# EasyEDA schematic easyeda-schematics.json

## Sheets
1 Digital Inputs: TITLE: Korg Volca Beats CV2MIDI / Analog inputs; REV: 1.0; Date: 2020-05-28; Sheet: 3/3; Drawn By: Arthur LAURENT; Company: N/A
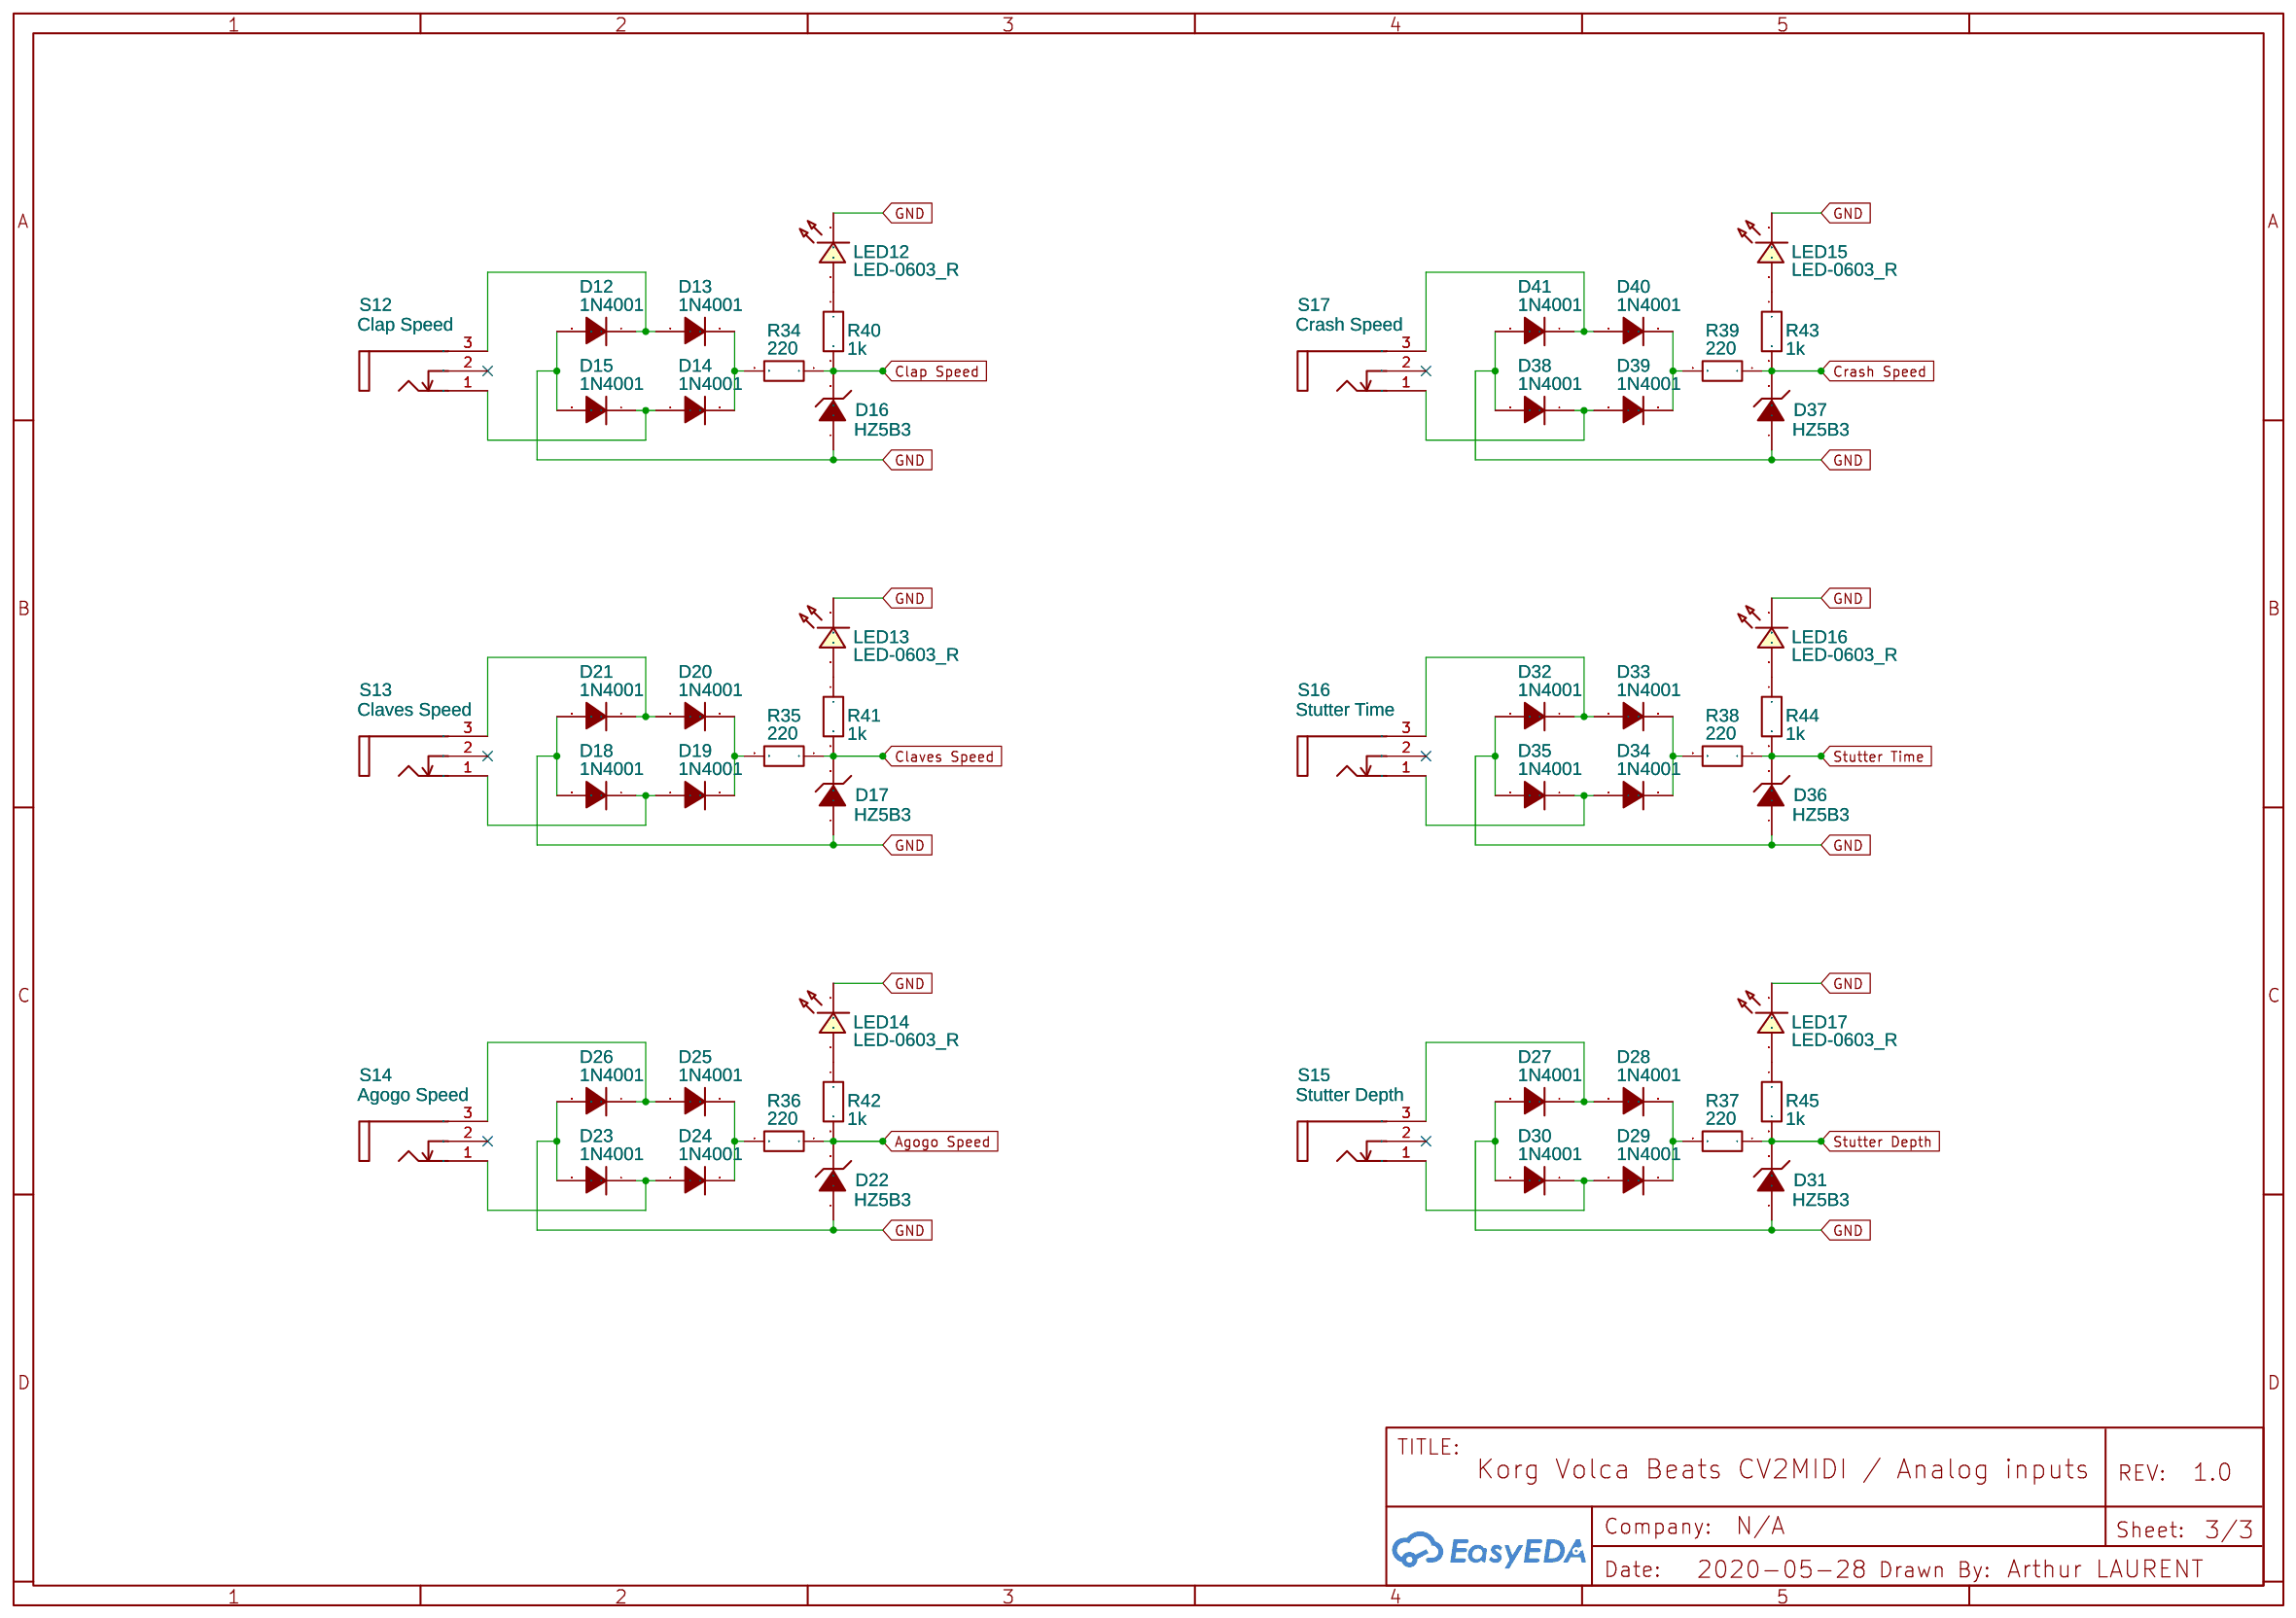
[diagram p0: Digital Inputs]
2 Arduino: TITLE: Korg Volca Beats CV2MIDI - Arduino; Sheet: 1/3
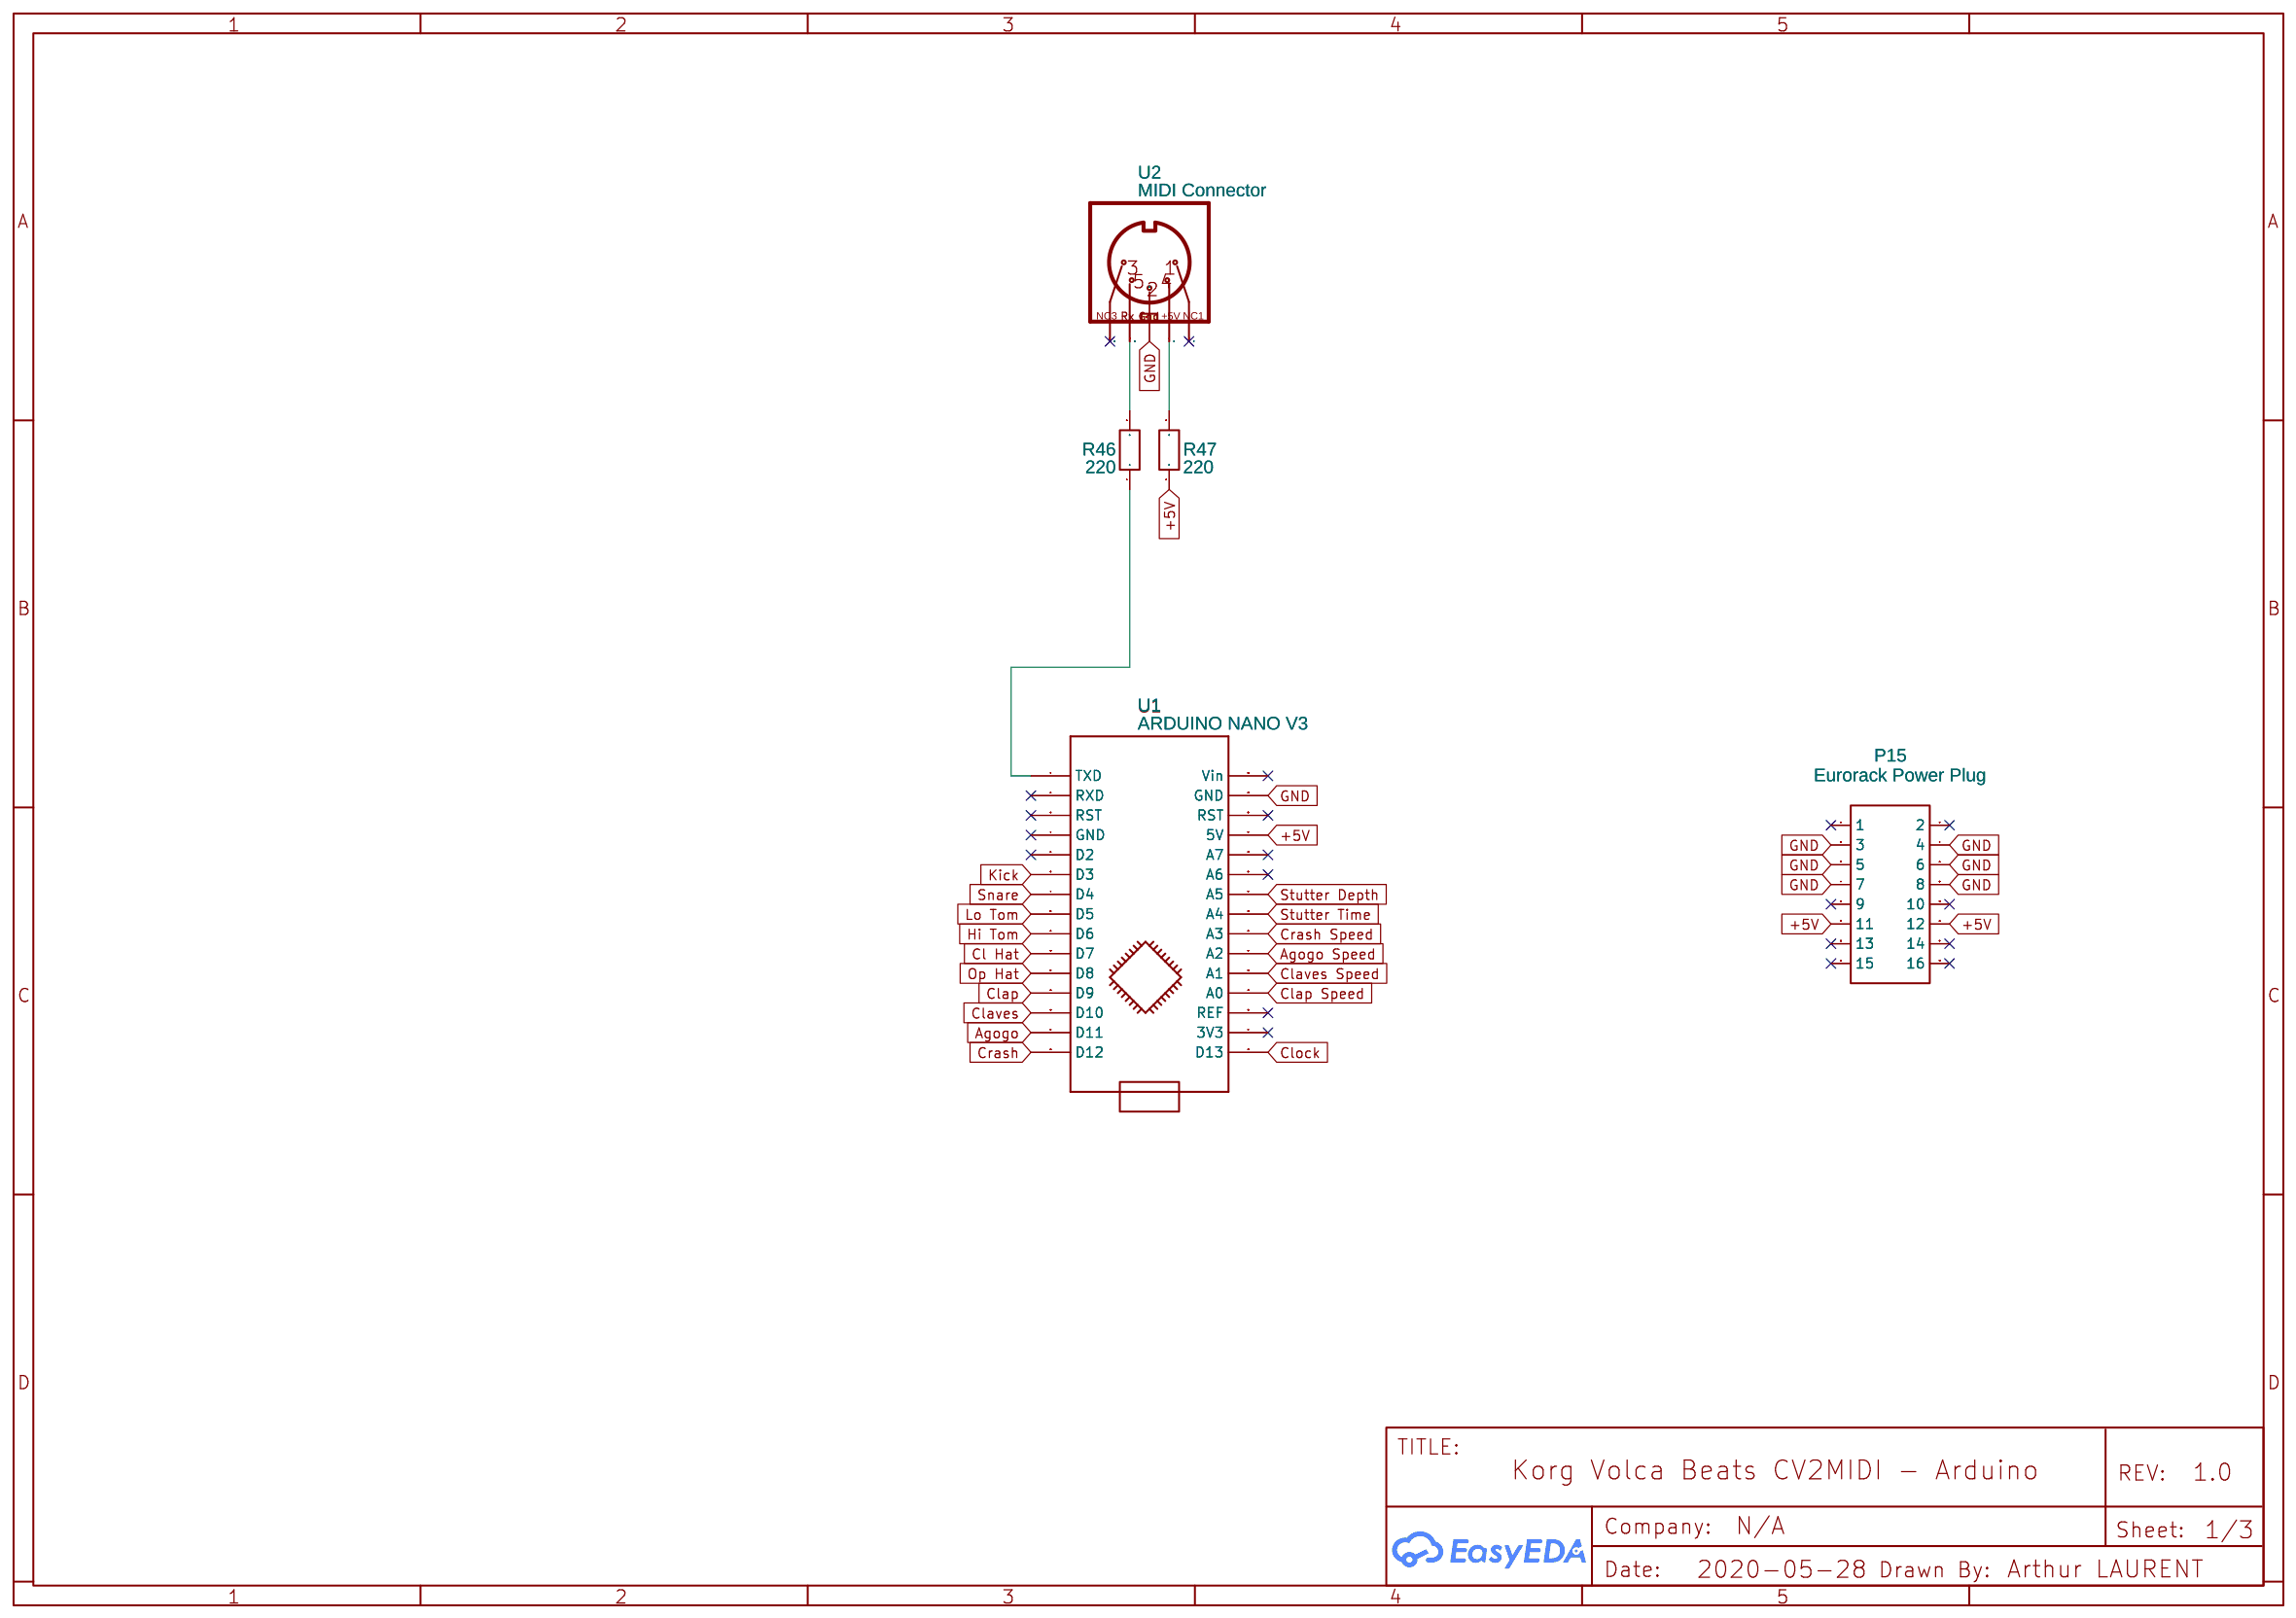
[diagram p1: Arduino]
3 Analog Inputs: TITLE: Korg Volca Beats CV2MIDI / Digital inputs; Sheet: 2/3
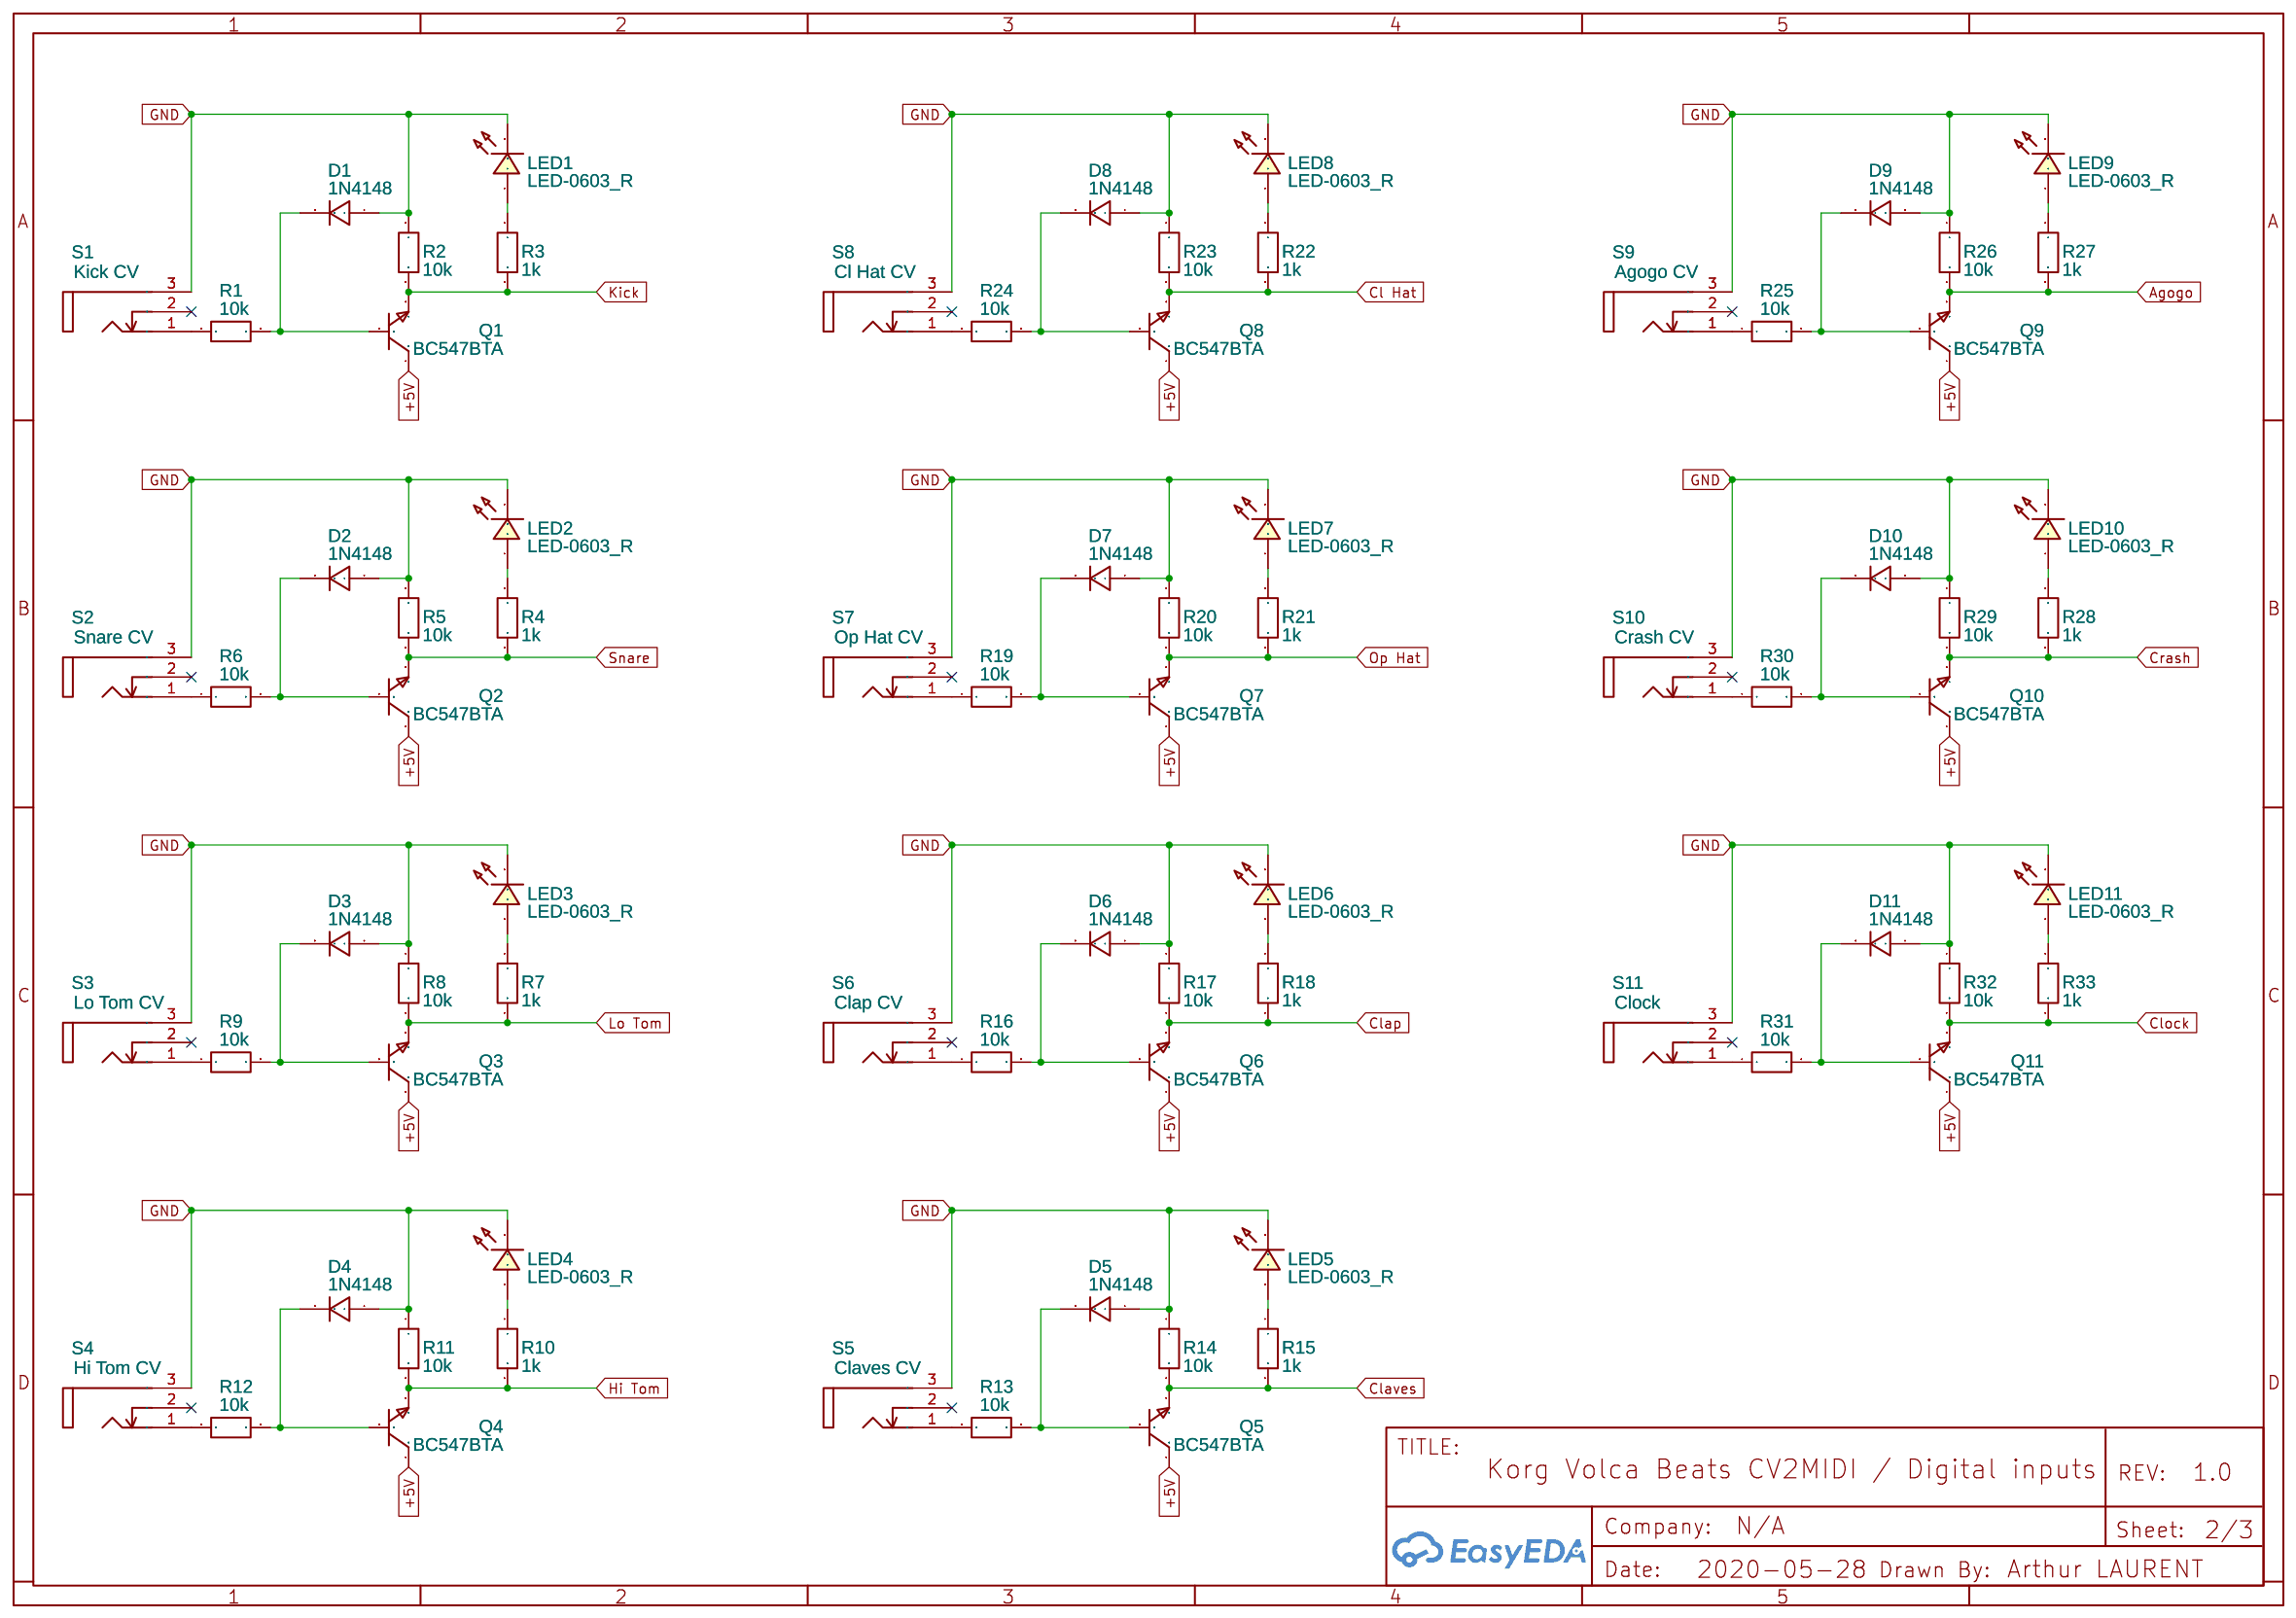
[diagram p2: Analog Inputs]

## Parts
sheet Analog Inputs
D1  1N4148  [DO-35]
D2  1N4148  [DO-35]
D3  1N4148  [DO-35]
D4  1N4148  [DO-35]
D5  1N4148  [DO-35]
D6  1N4148  [DO-35]
D7  1N4148  [DO-35]
D8  1N4148  [DO-35]
D9  1N4148  [DO-35]
D10  1N4148  [DO-35]
D11  1N4148  [DO-35]
LED1  LED-0603_R  [LED0603_RED]
LED2  LED-0603_R  [LED0603_RED]
LED3  LED-0603_R  [LED0603_RED]
LED4  LED-0603_R  [LED0603_RED]
LED5  LED-0603_R  [LED0603_RED]
LED6  LED-0603_R  [LED0603_RED]
LED7  LED-0603_R  [LED0603_RED]
LED8  LED-0603_R  [LED0603_RED]
LED9  LED-0603_R  [LED0603_RED]
LED10  LED-0603_R  [LED0603_RED]
LED11  LED-0603_R  [LED0603_RED]
Q1  BC547BTA  [TO-92-3_L4.8-W3.7-P2.54-L]
Q2  BC547BTA  [TO-92-3_L4.8-W3.7-P2.54-L]
Q3  BC547BTA  [TO-92-3_L4.8-W3.7-P2.54-L]
Q4  BC547BTA  [TO-92-3_L4.8-W3.7-P2.54-L]
Q5  BC547BTA  [TO-92-3_L4.8-W3.7-P2.54-L]
Q6  BC547BTA  [TO-92-3_L4.8-W3.7-P2.54-L]
Q7  BC547BTA  [TO-92-3_L4.8-W3.7-P2.54-L]
Q8  BC547BTA  [TO-92-3_L4.8-W3.7-P2.54-L]
Q9  BC547BTA  [TO-92-3_L4.8-W3.7-P2.54-L]
Q10  BC547BTA  [TO-92-3_L4.8-W3.7-P2.54-L]
Q11  BC547BTA  [TO-92-3_L4.8-W3.7-P2.54-L]
R1  10k  [R0201]
R2  10k  [R0201]
R3  1k  [R0201]
R4  1k  [R0201]
R5  10k  [R0201]
R6  10k  [R0201]
R7  1k  [R0201]
R8  10k  [R0201]
R9  10k  [R0201]
R10  1k  [R0201]
R11  10k  [R0201]
R12  10k  [R0201]
R13  10k  [R0201]
R14  10k  [R0201]
R15  1k  [R0201]
R16  10k  [R0201]
R17  10k  [R0201]
R18  1k  [R0201]
R19  10k  [R0201]
R20  10k  [R0201]
R21  1k  [R0201]
R22  1k  [R0201]
R23  10k  [R0201]
R24  10k  [R0201]
R25  10k  [R0201]
R26  10k  [R0201]
R27  1k  [R0201]
R28  1k  [R0201]
R29  10k  [R0201]
R30  10k  [R0201]
R31  10k  [R0201]
R32  10k  [R0201]
R33  1k  [R0201]
S1  Kick CV  [JACK-3PIN]
S2  Snare CV  [JACK-3PIN]
S3  Lo Tom CV  [JACK-3PIN]
S4  Hi Tom CV  [JACK-3PIN]
S5  Claves CV  [JACK-3PIN]
S6  Clap CV  [JACK-3PIN]
S7  Op Hat CV  [JACK-3PIN]
S8  Cl Hat CV  [JACK-3PIN]
S9  Agogo CV  [JACK-3PIN]
S10  Crash CV  [JACK-3PIN]
S11  Clock  [JACK-3PIN]
sheet Arduino
P15  Eurorack Power Plug  [IDC-TH_16P-P2.54_C3406]
R46  220  [R0201]
R47  220  [R0201]
U1  ARDUINO NANO V3  [ARDUINO NANO V3]
U2  MIDI Connector  [SDS-50J]
sheet Digital Inputs
D12  1N4001  [DO-41_BD2.4-L4.7-P8.70-D0.9-RD]
D13  1N4001  [DO-41_BD2.4-L4.7-P8.70-D0.9-RD]
D14  1N4001  [DO-41_BD2.4-L4.7-P8.70-D0.9-RD]
D15  1N4001  [DO-41_BD2.4-L4.7-P8.70-D0.9-RD]
D16  HZ5B3  [DO-35_BD2.0-L4.2-P8.20-D0.5-R-RD]
D17  HZ5B3  [DO-35_BD2.0-L4.2-P8.20-D0.5-R-RD]
D18  1N4001  [DO-41_BD2.4-L4.7-P8.70-D0.9-RD]
D19  1N4001  [DO-41_BD2.4-L4.7-P8.70-D0.9-RD]
D20  1N4001  [DO-41_BD2.4-L4.7-P8.70-D0.9-RD]
D21  1N4001  [DO-41_BD2.4-L4.7-P8.70-D0.9-RD]
D22  HZ5B3  [DO-35_BD2.0-L4.2-P8.20-D0.5-R-RD]
D23  1N4001  [DO-41_BD2.4-L4.7-P8.70-D0.9-RD]
D24  1N4001  [DO-41_BD2.4-L4.7-P8.70-D0.9-RD]
D25  1N4001  [DO-41_BD2.4-L4.7-P8.70-D0.9-RD]
D26  1N4001  [DO-41_BD2.4-L4.7-P8.70-D0.9-RD]
D27  1N4001  [DO-41_BD2.4-L4.7-P8.70-D0.9-RD]
D28  1N4001  [DO-41_BD2.4-L4.7-P8.70-D0.9-RD]
D29  1N4001  [DO-41_BD2.4-L4.7-P8.70-D0.9-RD]
D30  1N4001  [DO-41_BD2.4-L4.7-P8.70-D0.9-RD]
D31  HZ5B3  [DO-35_BD2.0-L4.2-P8.20-D0.5-R-RD]
D32  1N4001  [DO-41_BD2.4-L4.7-P8.70-D0.9-RD]
D33  1N4001  [DO-41_BD2.4-L4.7-P8.70-D0.9-RD]
D34  1N4001  [DO-41_BD2.4-L4.7-P8.70-D0.9-RD]
D35  1N4001  [DO-41_BD2.4-L4.7-P8.70-D0.9-RD]
D36  HZ5B3  [DO-35_BD2.0-L4.2-P8.20-D0.5-R-RD]
D37  HZ5B3  [DO-35_BD2.0-L4.2-P8.20-D0.5-R-RD]
D38  1N4001  [DO-41_BD2.4-L4.7-P8.70-D0.9-RD]
D39  1N4001  [DO-41_BD2.4-L4.7-P8.70-D0.9-RD]
D40  1N4001  [DO-41_BD2.4-L4.7-P8.70-D0.9-RD]
D41  1N4001  [DO-41_BD2.4-L4.7-P8.70-D0.9-RD]
LED12  LED-0603_R  [LED0603_RED]
LED13  LED-0603_R  [LED0603_RED]
LED14  LED-0603_R  [LED0603_RED]
LED15  LED-0603_R  [LED0603_RED]
LED16  LED-0603_R  [LED0603_RED]
LED17  LED-0603_R  [LED0603_RED]
R34  220  [R0201]
R35  220  [R0201]
R36  220  [R0201]
R37  220  [R0201]
R38  220  [R0201]
R39  220  [R0201]
R40  1k  [R0201]
R41  1k  [R0201]
R42  1k  [R0201]
R43  1k  [R0201]
R44  1k  [R0201]
R45  1k  [R0201]
S12  Clap Speed  [JACK-3PIN]
S13  Claves Speed  [JACK-3PIN]
S14  Agogo Speed  [JACK-3PIN]
S15  Stutter Depth  [JACK-3PIN]
S16  Stutter Time  [JACK-3PIN]
S17  Crash Speed  [JACK-3PIN]

## Library data of the parts
D1-D11 = 1N4148: Contributor: EasyEDA
LED1-LED17 = LED-0603_R: Manufacturer: EVERLIGHT(台湾亿光); Manufacturer Part: 19-217/R6C-AL1M2VY/3T; Supplier Part: C72044; Supplier: LCSC; Contributor: LCEDA_01
Q1-Q11 = BC547BTA: Supplier: LCSC; Supplier Part: C258144; Manufacturer: ON Semicon; Contributor: LCSC
R1-R47 = R_0201_EU: Contributor: LCEDA_Lib
S1-S17 = 3.5mm Jack Socket Mono: Contributor: daveh25
P15 = HDR-IDC-2.54-2X8P: Supplier: LCSC; Manufacturer: BOOMELE; Manufacturer Part: IDC Box 2.54mm 16P　Straight; image: //image.lceda.cn/szlcsc/C3406.jpg; Supplier Part: C3406
U1 = ARDUINO NANO V3: Manufacturer Part: arduino_nano1; Contributor: Labamich netvoll
U2 = MIDI Connector: Contributor: Janosch_89
D12-D15 D18-D21 D23-D30 D32-D35 D38-D41 = 1N4001: Supplier: LCSC; Manufacturer: LRC; Supplier Part: C82804
D16 D17 D22 D31 D36 D37 = HZ5B3: Supplier: LCSC; Manufacturer: SEMTECH; Supplier Part: C45643

## Nets
+5V: P15.11 P15.12 Q1.1(C) Q2.1(C) Q3.1(C) Q4.1(C) Q5.1(C) Q6.1(C) Q7.1(C) Q8.1(C) Q9.1(C) Q10.1(C) Q11.1(C) R47.1 U1.27(5V)
GND: D1.1(A) D2.1(A) D3.1(A) D4.1(A) D5.1(A) D6.1(A) D7.1(A) D8.1(A) D9.1(A) D10.1(A) D11.1(A) D12.2(A) D15.2(A) D16.1(A) D17.1(A) D18.2(A) D21.2(A) D22.1(A) D23.2(A) D26.2(A) D27.2(A) D30.2(A) D31.1(A) D32.2(A) D35.2(A) D36.1(A) D37.1(A) D38.2(A) D41.2(A) LED1.2 LED2.2 LED3.2 LED4.2 LED5.2 LED6.2 LED7.2 LED8.2 LED9.2 LED10.2 LED11.2 LED12.2 LED13.2 LED14.2 LED15.2 LED16.2 LED17.2 P15.3 P15.4 P15.5 P15.6 P15.7 P15.8 R2.1 R5.1 R8.1 R11.1 R14.1 R17.1 R20.1 R23.1 R26.1 R29.1 R32.1 S1.3(1) S2.3(1) S3.3(1) S4.3(1) S5.3(1) S6.3(1) S7.3(1) S8.3(1) S9.3(1) S10.3(1) S11.3(1) U1.29(GND) U2.2
Agogo: Q9.3(E) R26.2 R27.2 U1.14(D11)
Agogo Speed: D22.2(K) R36.1 R42.2 U1.21(A2)
Cl Hat: Q8.3(E) R22.2 R23.2 U1.10(D7)
Clap: Q6.3(E) R17.2 R18.2 U1.12(D9)
Clap Speed: D16.2(K) R34.1 R40.2 U1.19(A0)
Claves: Q5.3(E) R14.2 R15.2 U1.13(D10)
Claves Speed: D17.2(K) R35.1 R41.2 U1.20(A1)
Clock: Q11.3(E) R32.2 R33.2 U1.16(D13)
Crash: Q10.3(E) R28.2 R29.2 U1.15(D12)
Crash Speed: D37.2(K) R39.1 R43.2 U1.22(A3)
Hi Tom: Q4.3(E) R10.2 R11.2 U1.9(D6)
Kick: Q1.3(E) R2.2 R3.2 U1.6(D3)
Lo Tom: Q3.3(E) R7.2 R8.2 U1.8(D5)
Op Hat: Q7.3(E) R20.2 R21.2 U1.11(D8)
Snare: Q2.3(E) R4.2 R5.2 U1.7(D4)
Stutter Depth: D31.2(K) R37.1 R45.2 U1.24(A5)
Stutter Time: D36.2(K) R38.1 R44.2 U1.23(A4)
Net-(D1-2): D1.2(K) Q1.2(B) R1.2
Net-(D2-2): D2.2(K) Q2.2(B) R6.2
Net-(D3-2): D3.2(K) Q3.2(B) R9.2
Net-(D4-2): D4.2(K) Q4.2(B) R12.2
Net-(D5-2): D5.2(K) Q5.2(B) R13.2
Net-(D6-2): D6.2(K) Q6.2(B) R16.2
Net-(D7-2): D7.2(K) Q7.2(B) R19.2
Net-(D8-2): D8.2(K) Q8.2(B) R24.2
Net-(D9-2): D9.2(K) Q9.2(B) R25.2
Net-(D10-2): D10.2(K) Q10.2(B) R30.2
Net-(D11-2): D11.2(K) Q11.2(B) R31.2
Net-(D12-1): D12.1(K) D13.2(A) S12.3(1)
Net-(D13-1): D13.1(K) D14.1(K) R34.2
Net-(D14-2): D14.2(A) D15.1(K) S12.1(3)
Net-(D18-1): D18.1(K) D19.2(A) S13.1(3)
Net-(D19-1): D19.1(K) D20.1(K) R35.2
Net-(D20-2): D20.2(A) D21.1(K) S13.3(1)
Net-(D23-1): D23.1(K) D24.2(A) S14.1(3)
Net-(D24-1): D24.1(K) D25.1(K) R36.2
Net-(D25-2): D25.2(A) D26.1(K) S14.3(1)
Net-(D27-1): D27.1(K) D28.2(A) S15.3(1)
Net-(D28-1): D28.1(K) D29.1(K) R37.2
Net-(D29-2): D29.2(A) D30.1(K) S15.1(3)
Net-(D32-1): D32.1(K) D33.2(A) S16.3(1)
Net-(D33-1): D33.1(K) D34.1(K) R38.2
Net-(D34-2): D34.2(A) D35.1(K) S16.1(3)
Net-(D38-1): D38.1(K) D39.2(A) S17.1(3)
Net-(D39-1): D39.1(K) D40.1(K) R39.2
Net-(D40-2): D40.2(A) D41.1(K) S17.3(1)
Net-(LED1-1): LED1.1 R3.1
Net-(LED2-1): LED2.1 R4.1
Net-(LED3-1): LED3.1 R7.1
Net-(LED4-1): LED4.1 R10.1
Net-(LED5-1): LED5.1 R15.1
Net-(LED6-1): LED6.1 R18.1
Net-(LED7-1): LED7.1 R21.1
Net-(LED8-1): LED8.1 R22.1
Net-(LED9-1): LED9.1 R27.1
Net-(LED10-1): LED10.1 R28.1
Net-(LED11-1): LED11.1 R33.1
Net-(LED12-1): LED12.1 R40.1
Net-(LED13-1): LED13.1 R41.1
Net-(LED14-1): LED14.1 R42.1
Net-(LED15-1): LED15.1 R43.1
Net-(LED16-1): LED16.1 R44.1
Net-(LED17-1): LED17.1 R45.1
Net-(R1-1): R1.1 S1.1(3)
Net-(R6-1): R6.1 S2.1(3)
Net-(R9-1): R9.1 S3.1(3)
Net-(R12-1): R12.1 S4.1(3)
Net-(R13-1): R13.1 S5.1(3)
Net-(R16-1): R16.1 S6.1(3)
Net-(R19-1): R19.1 S7.1(3)
Net-(R24-1): R24.1 S8.1(3)
Net-(R25-1): R25.1 S9.1(3)
Net-(R30-1): R30.1 S10.1(3)
Net-(R31-1): R31.1 S11.1(3)
Net-(R46-1): R46.1 U1.1(TXD)
Net-(R46-2): R46.2 U2.5
Net-(R47-2): R47.2 U2.4

Not connected (* = marked no-connect by the designer): P15 1* 2* 9* 10* 13* 14* 15* 16*; S1 2*; S2 2*; S3 2*; S4 2*; S5 2*; S6 2*; S7 2*; S8 2*; S9 2*; S10 2*; S11 2*; S12 2*; S13 2*; S14 2*; S15 2*; S16 2*; S17 2*; U1 2(RXD)* 3(RST)* 4(GND)* 5(D2)* 17(3V3)* 18(REF)* 25(A6)* 26(A7)* 28(RST)* 30(Vin)*; U2 1* 3*
